# EAGLE design fet_board (EAGLE 7.2.0)
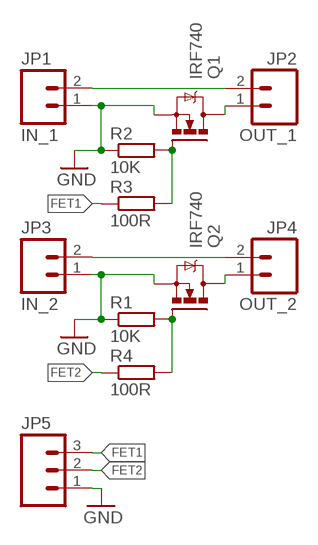
[diagram p0: schematic, sheet 1]

## Parts
JP1  IN_1  M023.5MM-NO_SILK  [SCREWTERMINAL-3.5MM-2-NS]
JP2  OUT_1  M023.5MM-NO_SILK  [SCREWTERMINAL-3.5MM-2-NS]
JP3  IN_2  M023.5MM-NO_SILK  [SCREWTERMINAL-3.5MM-2-NS]
JP4  OUT_2  M023.5MM-NO_SILK  [SCREWTERMINAL-3.5MM-2-NS]
JP5  M03POLAR_LOCK  [MOLEX-1X3_LOCK]
Q1  IRF740  [TO220BV]
Q2  IRF740  [TO220BV]
R1  10K  R-EU_R0805  [R0805]
R2  10K  R-EU_R0805  [R0805]
R3  100R  R-EU_R0805  [R0805]
R4  100R  R-EU_R0805  [R0805]

## Nets
FET1: JP5.3 R3.1
FET2: JP5.2 R4.1
GND: JP1.1 JP3.1 JP5.1 Q1.S Q2.S R1.1 R2.1
N$1: JP2.1 Q1.D
N$3: Q1.G R2.2 R3.2
N$4: JP4.1 Q2.D
N$6: Q2.G R1.2 R4.2
POWER1: JP1.2 JP2.2
POWER2: JP3.2 JP4.2

## Library data of the parts
JP1-JP4 = SparkFun-Connectors:M02: Standard 2-pin 0.1" header. Use with - straight break away headers ( PRT-00116) - right angle break away headers (PRT-00553) - swiss pins (PRT-00743) - machine pins (PRT-00117) - female headers (PRT-00115) Molex polarized connector foot print use with: PRT-08233 with associated crimp pins and housings. 2.54_SCREWTERM for use with PRT-10571. 3.5mm Screw Terminal footprints for PRT-08084 5mm Screw Terminal footprints for use with PRT-08432; PROD_ID: CONN-08399
JP5 = SparkFun-Connectors:M03: Header 3 Standard 3-pin 0.1" header. Use with straight break away headers (SKU : PRT-00116), right angle break away headers (PRT-00553), swiss pins (PRT-00743), machine pins (PRT-00117), and female headers (PRT-00115). Molex polarized connector foot print use with SKU : PRT-08232 with associated crimp pins and housings.
Q1 Q2 = transistor-power:IRF740: N-CHANNEL MOS FET
R1-R4 = rcl:R-EU_: RESISTOR, European symbol

## Board
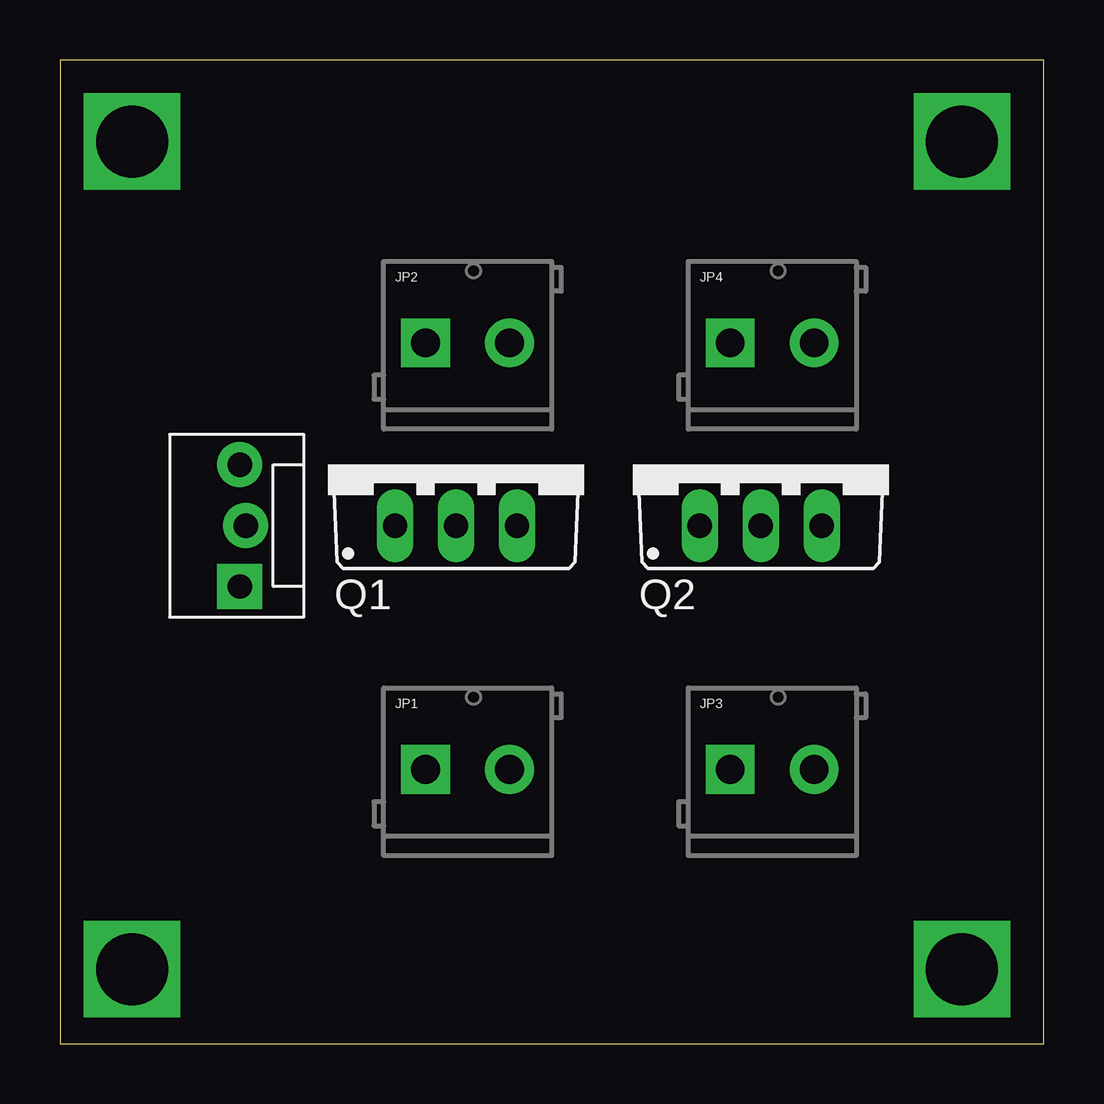
[diagram p1: board, top side]
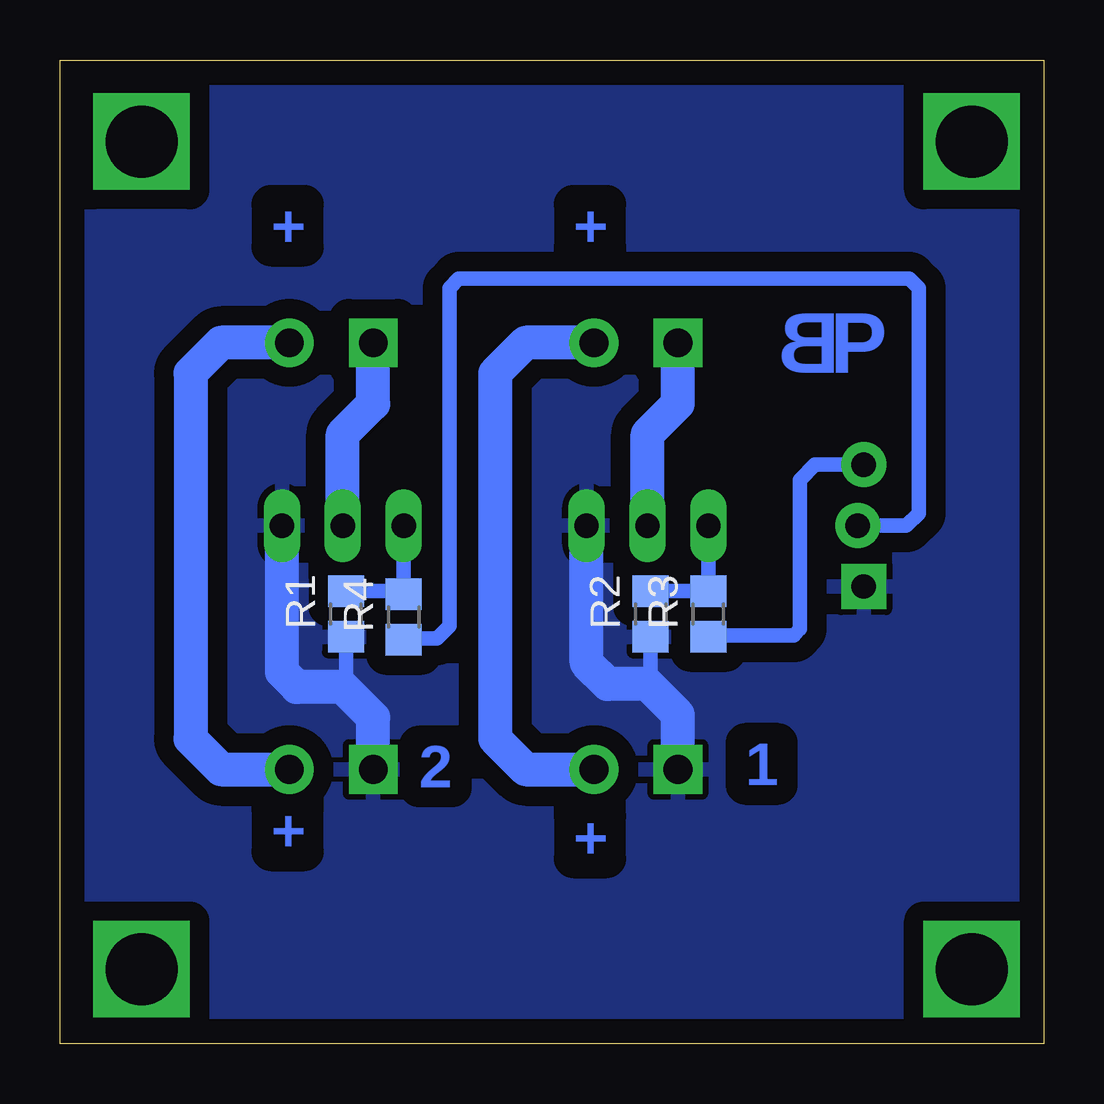
[diagram p2: board, bottom side, seen from below]

Size 41 x 41 mm. Coordinates in mm from the lower left corner, seen from the top.
Outline: 0,0 41,0 41,41 0,41 0,0
Copper layers (1*16): Top 0.035mm / dielectric 1.5mm / Bottom 0.035mm
Design rules "default": minimum track width 10mil, minimum drill 24mil, track to track 8mil, track to pad 8mil, pad to pad 8mil, via to via 8mil, smd to smd 8mil, copper to edge 40mil, drill to drill 8mil, minimum pad ring 10mil, minimum via ring 8mil, stop-mask expansion 4mil, vias tented up to drill 0mil, thermal gap 10mil

### Footprints (pad centres in the part's own frame; a part is rotated, then mirrored left to right if it is on the bottom)
SCREWTERMINAL-3.5MM-2-NS = drill 1.2 pad 2.032 square: 1 0,0 | drill 1.2 pad 2.032: 2 3.5,0
MOLEX-1X3_LOCK = drill 1.016 pad 1.88 square: 1 0,0.127 | drill 1.016 pad 1.88: 2 2.54,-0.127; 3 5.08,0.127
TO220BV = drill 1.016 long: D 0,-2.54; G -2.54,-2.54; S 2.54,-2.54
R0805 = smd 1.3 x 1.5: 1 -0.95,0; 2 0.95,0

### Placement (x,y rotation side)
JP1  15.24,11.43 0 top
JP2  15.24,29.21 0 top
JP3  27.94,11.43 0 top
JP4  27.94,29.21 0 top
JP5  7.62,19.05 90 top
Q1  16.51,24.13 0 top
Q2  29.21,24.13 0 top
R1  29.08,17.91 90 bottom
R2  16.38,17.91 90 bottom
R3  13.97,17.91 90 bottom
R4  26.67,17.78 90 bottom

### Tracks (layer width: path | path; a pad name or v marks a point on that pad's centre or on a via)
FET1
  Bottom 0.61: JP5.3 9.53,24.13 10.16,23.5 10.16,17.27 10.41,17.02 13.91,17.02 R3.1
FET2
  Bottom 0.61: JP5.2 5.71,21.59 5.21,22.1 5.21,31.5 5.59,31.88 24.38,31.88 24.77,31.5 24.77,17.4 25.27,16.89 26.61,16.89 R4.1
GND
  Bottom 0.61: R2.1 16.38,15.11 16.51,14.99 | R1.1 29.08,14.99 29.21,14.86
  Bottom 1.422: JP1.1 15.24,13.72 16.51,14.99 18.16,14.99 19.05,15.88 Q1.S | JP3.1 27.94,13.59 29.21,14.86 31.11,14.86 31.75,15.49 Q2.S
  pour Bottom (isolate 0.813): 0,41.37 41.37,41.37 41.37,0 0,0
N$1
  Bottom 1.422: Q1.D 16.51,25.4 15.24,26.67 JP2.1
N$3
  Bottom 0.61: R2.2 R3.2 Q1.G
N$4
  Bottom 1.422: Q2.D 29.21,25.4 27.94,26.67 JP4.1
N$5  (via drill 3)
  other vias: 3,37.6
N$6
  Bottom 0.61: R1.2 26.8,18.86 R4.2 Q2.G
N$7  (via drill 3)
  other vias: 37.6,37.6
N$8  (via drill 3)
  other vias: 37.6,3.1
N$9  (via drill 3)
  other vias: 3,3.1
POWER1
  Bottom 1.422: JP2.2 21.59,29.21 22.86,27.94 22.86,12.7 21.59,11.43 JP1.2
POWER2
  Bottom 1.422: JP4.2 34.29,29.21 35.56,27.94 35.56,12.7 34.29,11.43 JP3.2

### Text on the board
Bottom: + | + | B | P | 1 | 2 | + | +